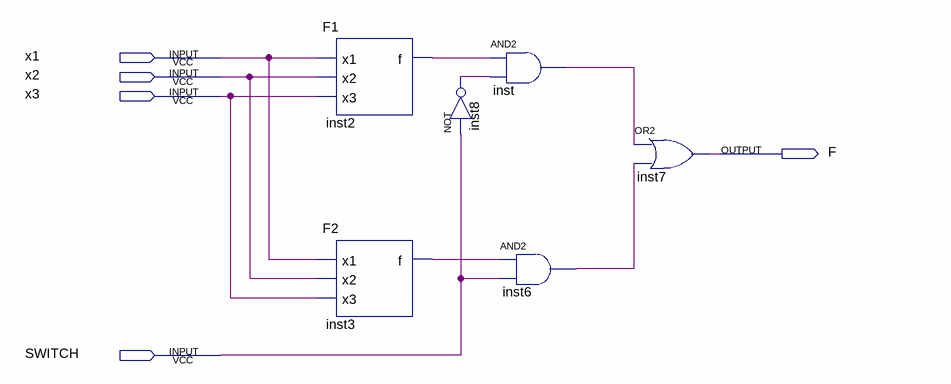
[diagram p0: schematic sheet]
// Quartus schematic EDWARD1.bdf as structural Verilog: 6 symbols, 5 pins
module EDWARD1 (
  input  x1,
  input  x2,
  input  x3,
  input  SWITCH,
  output F
);

  wire inst2_f, inst3_f, inst6_out, inst8_out, inst_out;

  F1 inst2 (.x1(x1), .x2(x2), .x3(x3), .f(inst2_f));
  F2 inst3 (.x1(x1), .x2(x2), .x3(x3), .f(inst3_f));
  not inst8 (inst8_out, SWITCH);
  and inst (inst_out, inst2_f, inst8_out);
  and inst6 (inst6_out, inst3_f, SWITCH);
  or inst7 (F, inst_out, inst6_out);
endmodule
